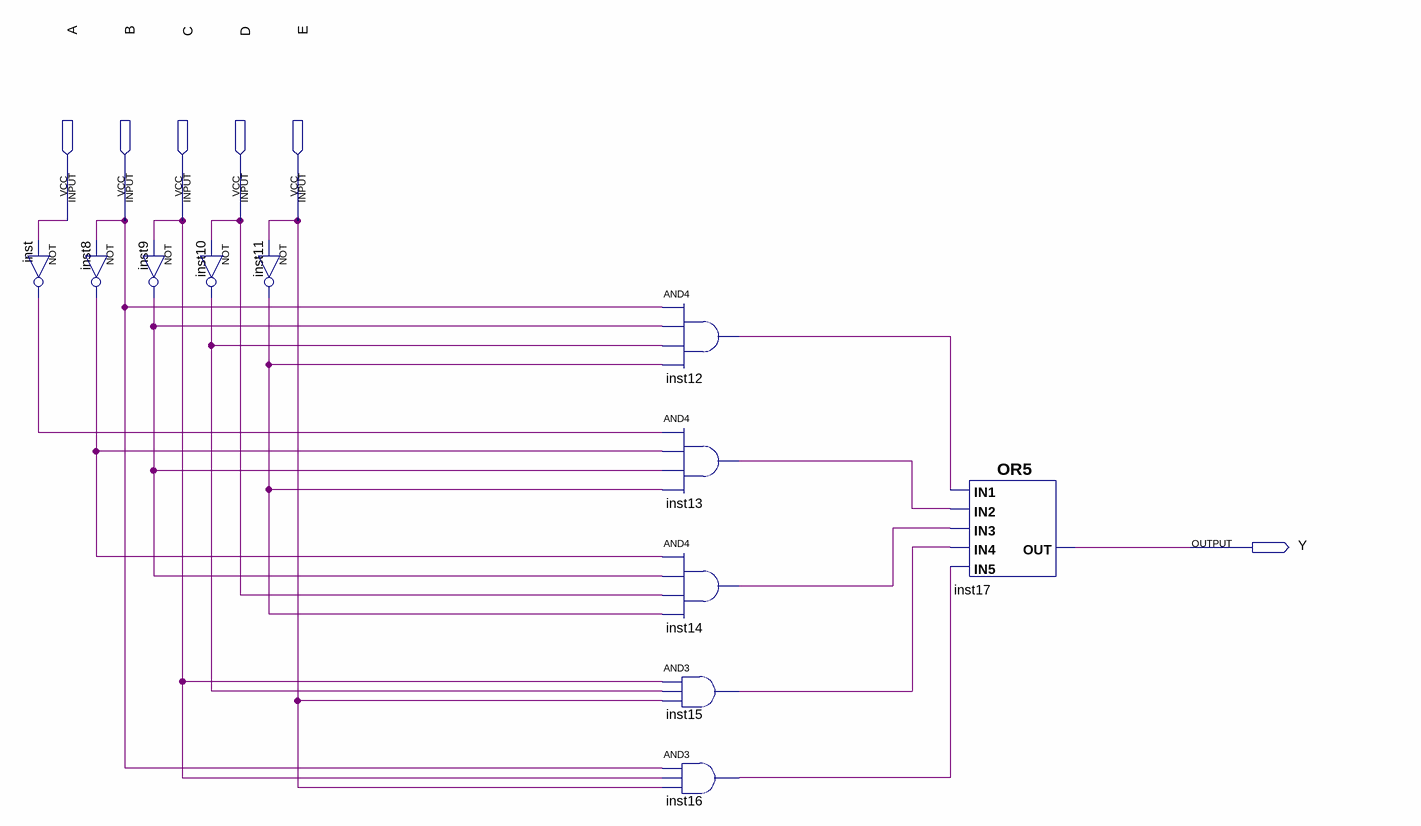
[diagram p0: schematic sheet]
// Quartus schematic circuito1.bdf as structural Verilog: 11 symbols, 6 pins
module circuito1 (
  input  A,
  input  B,
  input  C,
  input  D,
  input  E,
  output Y
);

  wire inst8_out, inst9_out, inst10_out, inst11_out, inst12_out, inst13_out, inst14_out, inst15_out,
       inst16_out, inst_out;

  not inst (inst_out, A);
  not inst8 (inst8_out, B);
  not inst9 (inst9_out, C);
  not inst10 (inst10_out, D);
  not inst11 (inst11_out, E);
  and inst12 (inst12_out, B, inst9_out, inst10_out, inst11_out);
  and inst13 (inst13_out, inst_out, inst8_out, inst9_out, inst11_out);
  and inst14 (inst14_out, inst8_out, inst9_out, D, inst11_out);
  and inst15 (inst15_out, C, inst10_out, E);
  and inst16 (inst16_out, B, C, E);
  or inst17 (Y, inst12_out, inst13_out, inst14_out, inst15_out, inst16_out);
endmodule
